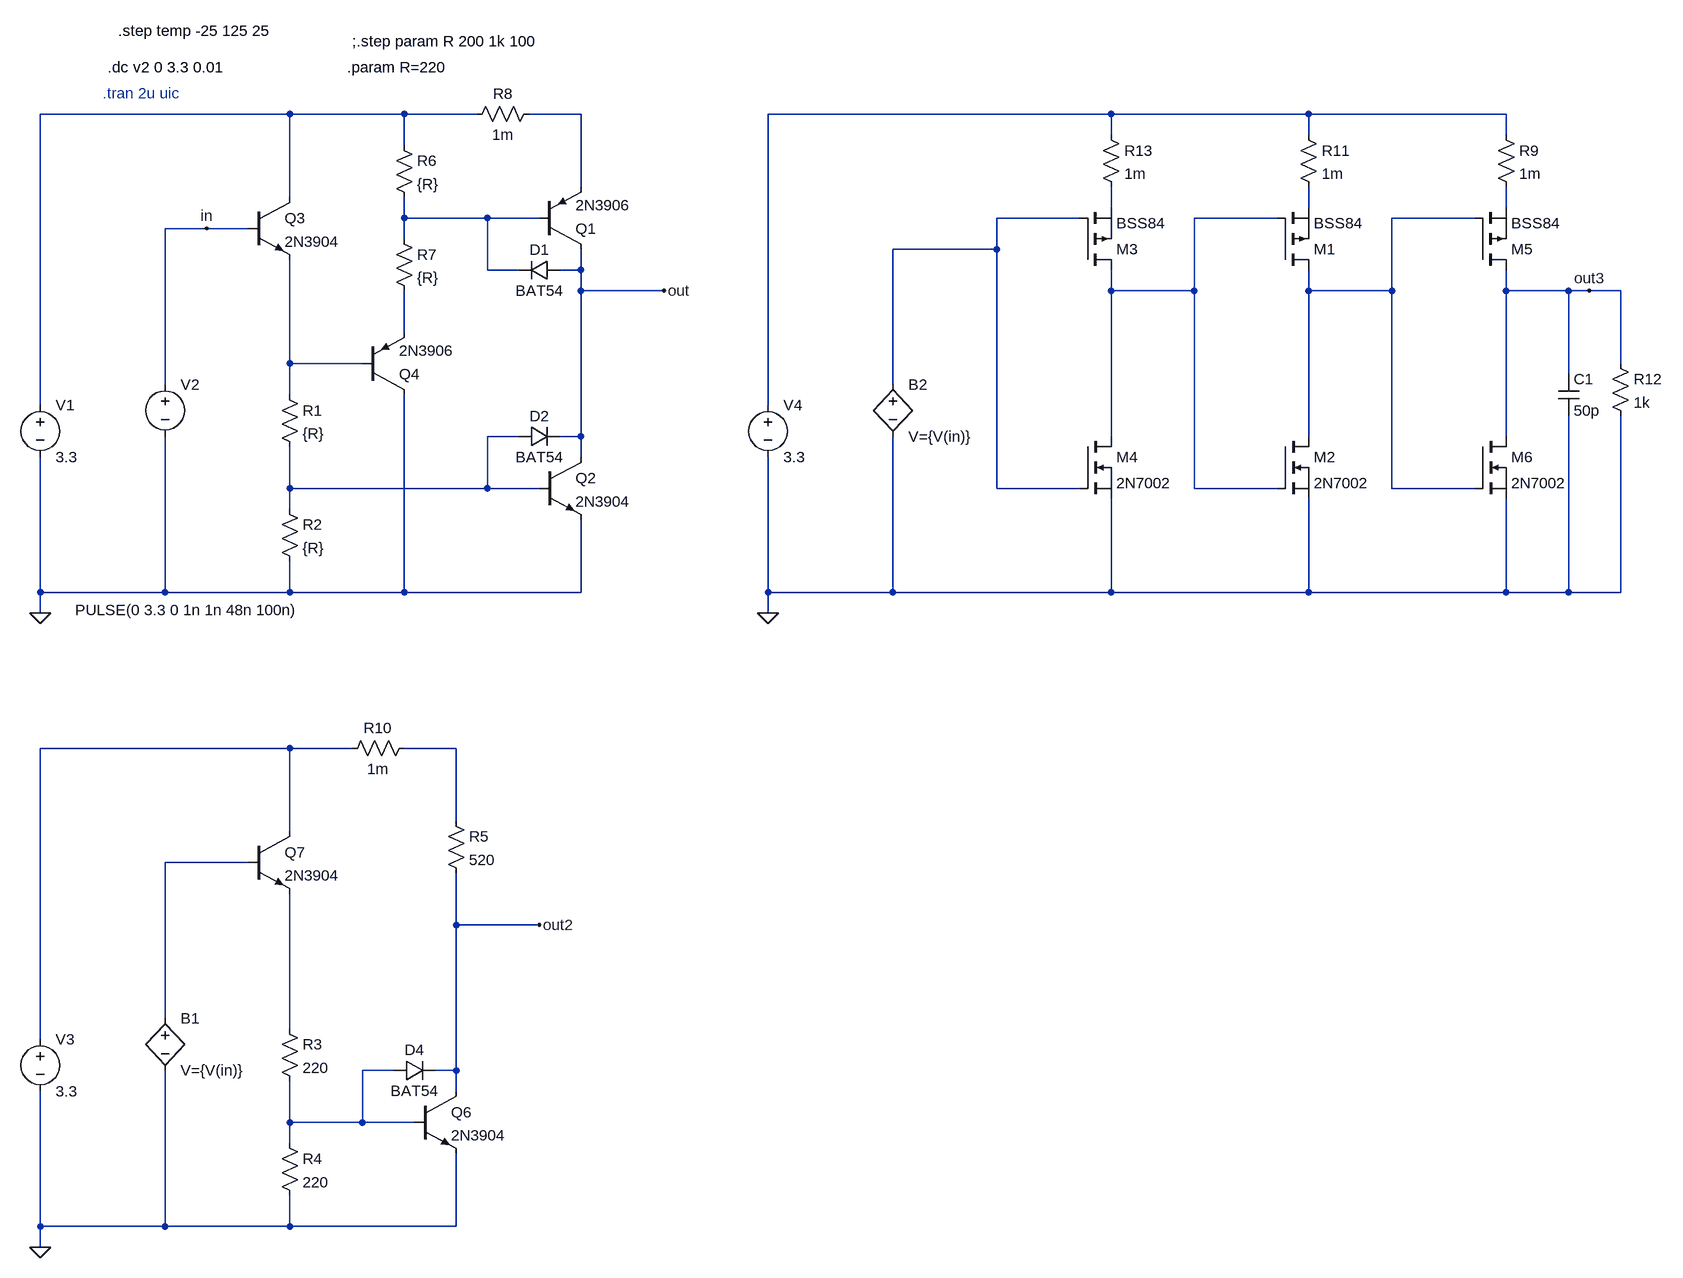
[diagram p0: schematic push_pull_inverter1.asc]
push_pull_inverter1.asc, the LTspice schematic file:
Version 4.1
SHEET 1 2740 1444
WIRE 624 -320 240 -320
WIRE 800 -320 624 -320
WIRE 912 -320 800 -320
WIRE 1072 -320 992 -320
WIRE 1888 -320 1360 -320
WIRE 2192 -320 1888 -320
WIRE 2496 -320 2192 -320
WIRE 1888 -288 1888 -320
WIRE 2192 -288 2192 -320
WIRE 2496 -288 2496 -320
WIRE 800 -272 800 -320
WIRE 1072 -208 1072 -320
WIRE 624 -192 624 -320
WIRE 1888 -176 1888 -208
WIRE 2192 -176 2192 -208
WIRE 2496 -176 2496 -208
WIRE 800 -160 800 -192
WIRE 928 -160 800 -160
WIRE 1008 -160 928 -160
WIRE 1840 -160 1712 -160
WIRE 2144 -160 2016 -160
WIRE 2448 -160 2320 -160
WIRE 496 -144 432 -144
WIRE 560 -144 496 -144
WIRE 800 -128 800 -160
WIRE 1712 -112 1712 -160
WIRE 1712 -112 1552 -112
WIRE 928 -80 928 -160
WIRE 976 -80 928 -80
WIRE 1072 -80 1072 -112
WIRE 1072 -80 1040 -80
WIRE 1072 -48 1072 -80
WIRE 1200 -48 1072 -48
WIRE 1888 -48 1888 -80
WIRE 2016 -48 2016 -160
WIRE 2016 -48 1888 -48
WIRE 2192 -48 2192 -80
WIRE 2320 -48 2320 -160
WIRE 2320 -48 2192 -48
WIRE 2496 -48 2496 -80
WIRE 2592 -48 2496 -48
WIRE 2624 -48 2592 -48
WIRE 2672 -48 2624 -48
WIRE 800 16 800 -48
WIRE 624 64 624 -96
WIRE 736 64 624 64
WIRE 2672 64 2672 -48
WIRE 2592 80 2592 -48
WIRE 432 96 432 -144
WIRE 1552 96 1552 -112
WIRE 624 112 624 64
WIRE 240 128 240 -320
WIRE 1360 128 1360 -320
WIRE 976 176 928 176
WIRE 1072 176 1072 -48
WIRE 1072 176 1040 176
WIRE 1888 176 1888 -48
WIRE 2192 176 2192 -48
WIRE 2496 176 2496 -48
WIRE 1072 208 1072 176
WIRE 624 256 624 192
WIRE 928 256 928 176
WIRE 928 256 624 256
WIRE 1008 256 928 256
WIRE 1712 256 1712 -112
WIRE 1840 256 1712 256
WIRE 2016 256 2016 -48
WIRE 2144 256 2016 256
WIRE 2320 256 2320 -48
WIRE 2448 256 2320 256
WIRE 624 288 624 256
WIRE 240 416 240 208
WIRE 432 416 432 176
WIRE 432 416 240 416
WIRE 624 416 624 368
WIRE 624 416 432 416
WIRE 800 416 800 112
WIRE 800 416 624 416
WIRE 1072 416 1072 304
WIRE 1072 416 800 416
WIRE 1360 416 1360 208
WIRE 1552 416 1552 176
WIRE 1552 416 1360 416
WIRE 1888 416 1888 272
WIRE 1888 416 1552 416
WIRE 2192 416 2192 272
WIRE 2192 416 1888 416
WIRE 2496 416 2496 272
WIRE 2496 416 2192 416
WIRE 2592 416 2592 144
WIRE 2592 416 2496 416
WIRE 2672 416 2672 144
WIRE 2672 416 2592 416
WIRE 240 448 240 416
WIRE 1360 448 1360 416
WIRE 624 656 240 656
WIRE 720 656 624 656
WIRE 880 656 800 656
WIRE 880 768 880 656
WIRE 624 784 624 656
WIRE 560 832 432 832
WIRE 880 928 880 848
WIRE 1008 928 880 928
WIRE 432 1072 432 832
WIRE 624 1088 624 880
WIRE 240 1104 240 656
WIRE 784 1152 736 1152
WIRE 880 1152 880 928
WIRE 880 1152 848 1152
WIRE 880 1184 880 1152
WIRE 624 1232 624 1168
WIRE 736 1232 736 1152
WIRE 736 1232 624 1232
WIRE 816 1232 736 1232
WIRE 624 1264 624 1232
WIRE 240 1392 240 1184
WIRE 432 1392 432 1152
WIRE 432 1392 240 1392
WIRE 624 1392 624 1344
WIRE 624 1392 432 1392
WIRE 880 1392 880 1280
WIRE 880 1392 624 1392
WIRE 240 1424 240 1392
FLAG 240 448 0
FLAG 1200 -48 out
FLAG 240 1424 0
FLAG 1008 928 out2
FLAG 496 -144 in
FLAG 1360 448 0
FLAG 2624 -48 out3
SYMBOL voltage 240 112 R0
SYMATTR InstName V1
SYMATTR Value 3.3
SYMBOL pnp 1008 -112 M180
SYMATTR InstName Q1
SYMATTR Value 2N3906
SYMBOL npn 1008 208 R0
SYMATTR InstName Q2
SYMATTR Value 2N3904
SYMBOL voltage 432 80 R0
WINDOW 3 -138 363 Left 2
WINDOW 123 0 0 Left 0
WINDOW 39 0 0 Left 0
SYMATTR Value PULSE(0 3.3 0 1n 1n 48n 100n)
SYMATTR InstName V2
SYMBOL npn 560 -192 R0
SYMATTR InstName Q3
SYMATTR Value 2N3904
SYMBOL res 608 96 R0
SYMATTR InstName R1
SYMATTR Value {R}
SYMBOL res 608 272 R0
SYMATTR InstName R2
SYMATTR Value {R}
SYMBOL pnp 736 112 M180
SYMATTR InstName Q4
SYMATTR Value 2N3906
SYMBOL res 784 -288 R0
SYMATTR InstName R6
SYMATTR Value {R}
SYMBOL res 784 -144 R0
SYMATTR InstName R7
SYMATTR Value {R}
SYMBOL res 896 -304 R270
WINDOW 0 32 56 VTop 2
WINDOW 3 0 56 VBottom 2
SYMATTR InstName R8
SYMATTR Value 1m
SYMBOL diode 1040 -96 R90
WINDOW 0 0 32 VBottom 2
WINDOW 3 32 32 VTop 2
SYMATTR InstName D1
SYMATTR Value BAT54
SYMBOL diode 976 192 R270
WINDOW 0 32 32 VTop 2
WINDOW 3 0 32 VBottom 2
SYMATTR InstName D2
SYMATTR Value BAT54
SYMBOL voltage 240 1088 R0
SYMATTR InstName V3
SYMATTR Value 3.3
SYMBOL npn 816 1184 R0
SYMATTR InstName Q6
SYMATTR Value 2N3904
SYMBOL npn 560 784 R0
SYMATTR InstName Q7
SYMATTR Value 2N3904
SYMBOL res 608 1072 R0
SYMATTR InstName R3
SYMATTR Value 220
SYMBOL res 608 1248 R0
SYMATTR InstName R4
SYMATTR Value 220
SYMBOL res 704 672 R270
WINDOW 0 32 56 VTop 2
WINDOW 3 0 56 VBottom 2
SYMATTR InstName R10
SYMATTR Value 1m
SYMBOL diode 784 1168 R270
WINDOW 0 32 32 VTop 2
WINDOW 3 0 32 VBottom 2
SYMATTR InstName D4
SYMATTR Value BAT54
SYMBOL res 864 752 R0
SYMATTR InstName R5
SYMATTR Value 520
SYMBOL bv 432 1056 R0
SYMATTR InstName B1
SYMATTR Value V={V(in)}
SYMBOL voltage 1360 112 R0
SYMATTR InstName V4
SYMATTR Value 3.3
SYMBOL bv 1552 80 R0
SYMATTR InstName B2
SYMATTR Value V={V(in)}
SYMBOL pmos 2144 -80 M180
SYMATTR InstName M1
SYMATTR Value BSS84
SYMBOL nmos 2144 176 R0
SYMATTR InstName M2
SYMATTR Value 2N7002
SYMBOL pmos 1840 -80 M180
SYMATTR InstName M3
SYMATTR Value BSS84
SYMBOL nmos 1840 176 R0
SYMATTR InstName M4
SYMATTR Value 2N7002
SYMBOL pmos 2448 -80 M180
SYMATTR InstName M5
SYMATTR Value BSS84
SYMBOL nmos 2448 176 R0
SYMATTR InstName M6
SYMATTR Value 2N7002
SYMBOL cap 2576 80 R0
SYMATTR InstName C1
SYMATTR Value 50p
SYMBOL res 2656 48 R0
SYMATTR InstName R12
SYMATTR Value 1k
SYMBOL res 2480 -304 R0
SYMATTR InstName R9
SYMATTR Value 1m
SYMBOL res 2176 -304 R0
SYMATTR InstName R11
SYMATTR Value 1m
SYMBOL res 1872 -304 R0
SYMATTR InstName R13
SYMATTR Value 1m
TEXT 344 -392 Left 2 !.dc v2 0 3.3 0.01
TEXT 336 -352 Left 2 ;.tran 2u uic
TEXT 360 -448 Left 2 !.step temp -25 125 25
TEXT 720 -432 Left 2 !;.step param R 200 1k 100
TEXT 712 -392 Left 2 !.param R=220

The netlist it stands for:
* push_pull_inverter1.asc
V1 N001 0 3.3
Q1 out N007 N002 0 2N3906
Q2 out N013 0 0 2N3904
V2 in 0 PULSE(0 3.3 0 1n 1n 48n 100n)
Q3 N001 in N012 0 2N3904
R1 N012 N013 {R}
R2 N013 0 {R}
Q4 0 N012 N011 0 2N3906
R6 N001 N007 {R}
R7 N007 N011 {R}
R8 N001 N002 1m
D1 out N007 BAT54
D2 N013 out BAT54
V3 N014 0 3.3
Q6 out2 N018 0 0 2N3904
Q7 N014 N016 N017 0 2N3904
R3 N017 N018 220
R4 N018 0 220
R10 N014 N015 1m
D4 N018 out2 BAT54
R5 N015 out2 520
B1 N016 0 V={V(in)}
V4 N003 0 3.3
B2 N008 0 V={V(in)}
M1 N010 N009 N005 N005 BSS84
M2 N010 N009 0 0 2N7002
M3 N009 N008 N004 N004 BSS84
M4 N009 N008 0 0 2N7002
M5 out3 N010 N006 N006 BSS84
M6 out3 N010 0 0 2N7002
C1 out3 0 50p
R12 out3 0 1k
R9 N003 N006 1m
R11 N003 N005 1m
R13 N003 N004 1m
.model D D
.lib standard.dio
.model NPN NPN
.model PNP PNP
.lib standard.bjt
.model NMOS NMOS
.model PMOS PMOS
.lib standard.mos
.dc v2 0 3.3 0.01
* .tran 2u uic
.step temp -25 125 25
;.step param R 200 1k 100
.param R=220
.backanno
.end